# EAGLE design wire M (EAGLE 6.1)
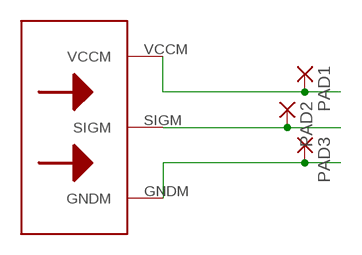
[diagram p0: schematic, sheet 1]

## Parts
PAD1  SMD5  [SMD2,54-5,08]
PAD2  SMD5  [SMD2,54-5,08]
PAD3  SMD5  [SMD2,54-5,08]
U$2  BITWIREM  [BITWIREM]

## Nets
N$1: PAD1.1(P) U$2.VCCM
N$2: PAD2.1(P) U$2.SIGM
N$6: PAD3.1(P) U$2.GNDM

## Library data of the parts
PAD1-PAD3 = wirepad:SMD5: SMD PAD
U$2 = bigbits:BITWIREM: BitWire Male Entrada de Sínal <<---

## Board
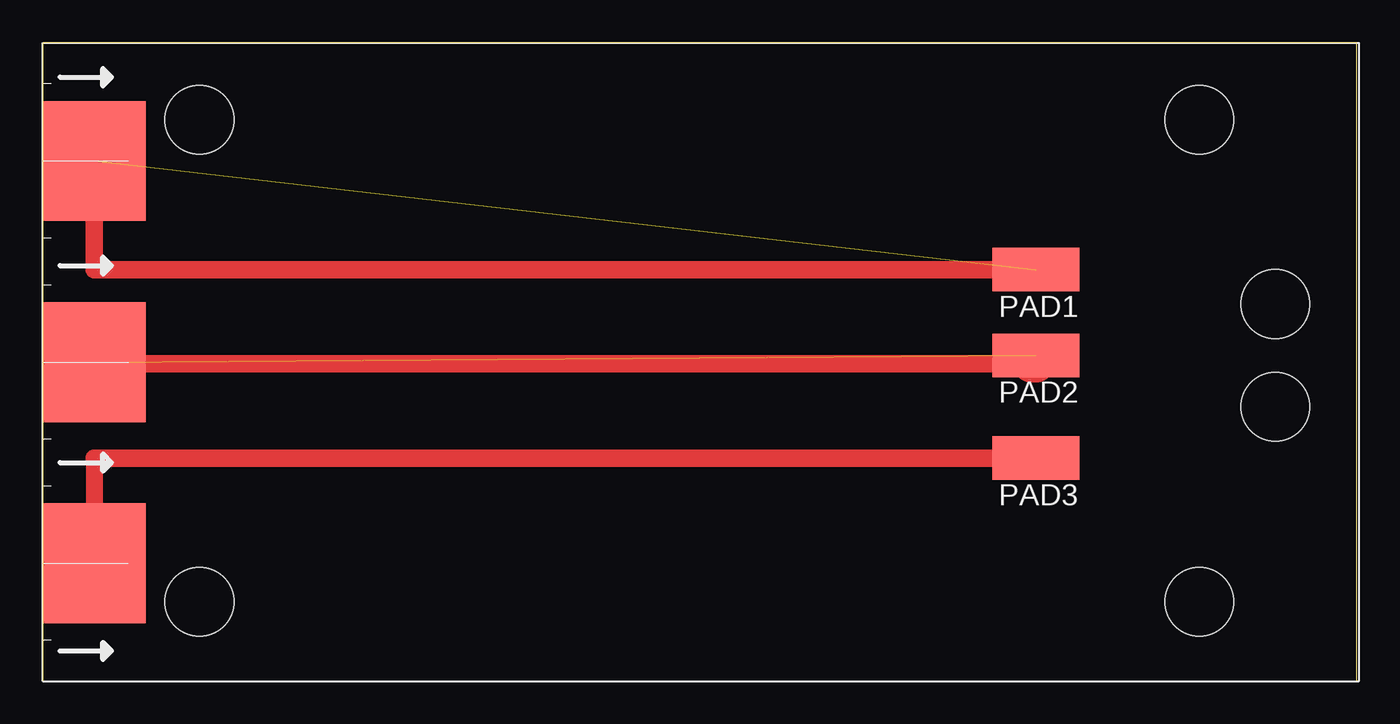
[diagram p1: board, top side]

Size 76.75 x 37.25 mm. Coordinates in mm from the lower left corner, seen from the top.
Outline: 76.75,0 76.75,37.25 0,37.25 0,0
Copper layers (1*16): Top 0.035mm / dielectric 1.5mm / Bottom 0.035mm
Design rules: minimum track width 10mil, minimum drill 24mil, track to track 8mil, track to pad 8mil, pad to pad 8mil, via to via 8mil, smd to smd 8mil, copper to edge 40mil, drill to drill 8mil, minimum pad ring 10mil, minimum via ring 8mil, stop-mask expansion 4mil, vias tented up to drill 0mil, thermal gap 10mil
Holes 4 mm at 72,22 72,16

### Footprints (pad centres in the part's own frame; a part is rotated, then mirrored left to right if it is on the bottom)
SMD2,54-5,08 = smd 2.54 x 5.08: 1 0,0
BITWIREM = smd 6 x 7: GNDM 3,-30.39; SIGM 3,-18.65; VCCM 3,-6.9 | hole 4: 9.15,-4.5; 9.15,-32.64; 67.55,-4.5; 67.55,-32.64

### Placement (x,y rotation side)
PAD1  58,24 90 top
PAD2  58,19 90 top
PAD3  58,13 90 top
U$2  0,37.25 0 top

### Tracks (layer width: path | path; a pad name or v marks a point on that pad's centre or on a via)
N$1  (1 unrouted)
N$2  (1 unrouted)
  Top 1: 3,18.5 U$2.SIGM
N$4
  Top 1.016: 58.25,24 3,24 3,30
  Top 2.184: 59,24 58.25,24
N$5
  Top 1.016: 57.75,18.5 3,18.5 3,18.75
  Top 2.184: 57.75,18.5 58,18.5
N$6
  Top 1: 3,13 U$2.GNDM
  Top 1.016: PAD3.1 3,13
  Top 2.184: 59,13 PAD3.1